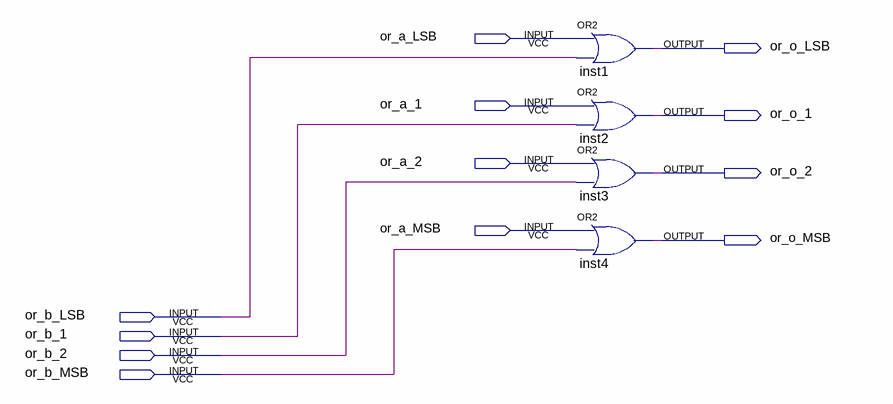
[diagram p0: schematic sheet]
// Quartus schematic 4bit_or.bdf as structural Verilog: 4 symbols, 12 pins
module \4bit_or  (
  input  or_a_LSB,
  input  or_a_1,
  input  or_a_2,
  input  or_a_MSB,
  input  or_b_LSB,
  input  or_b_1,
  input  or_b_2,
  input  or_b_MSB,
  output or_o_LSB,
  output or_o_1,
  output or_o_2,
  output or_o_MSB
);

  or inst1 (or_o_LSB, or_a_LSB, or_b_LSB);
  or inst2 (or_o_1, or_a_1, or_b_1);
  or inst3 (or_o_2, or_a_2, or_b_2);
  or inst4 (or_o_MSB, or_a_MSB, or_b_MSB);
endmodule
